# EAGLE schematic PRN_S2_v1.0 (EAGLE 9.3.0)
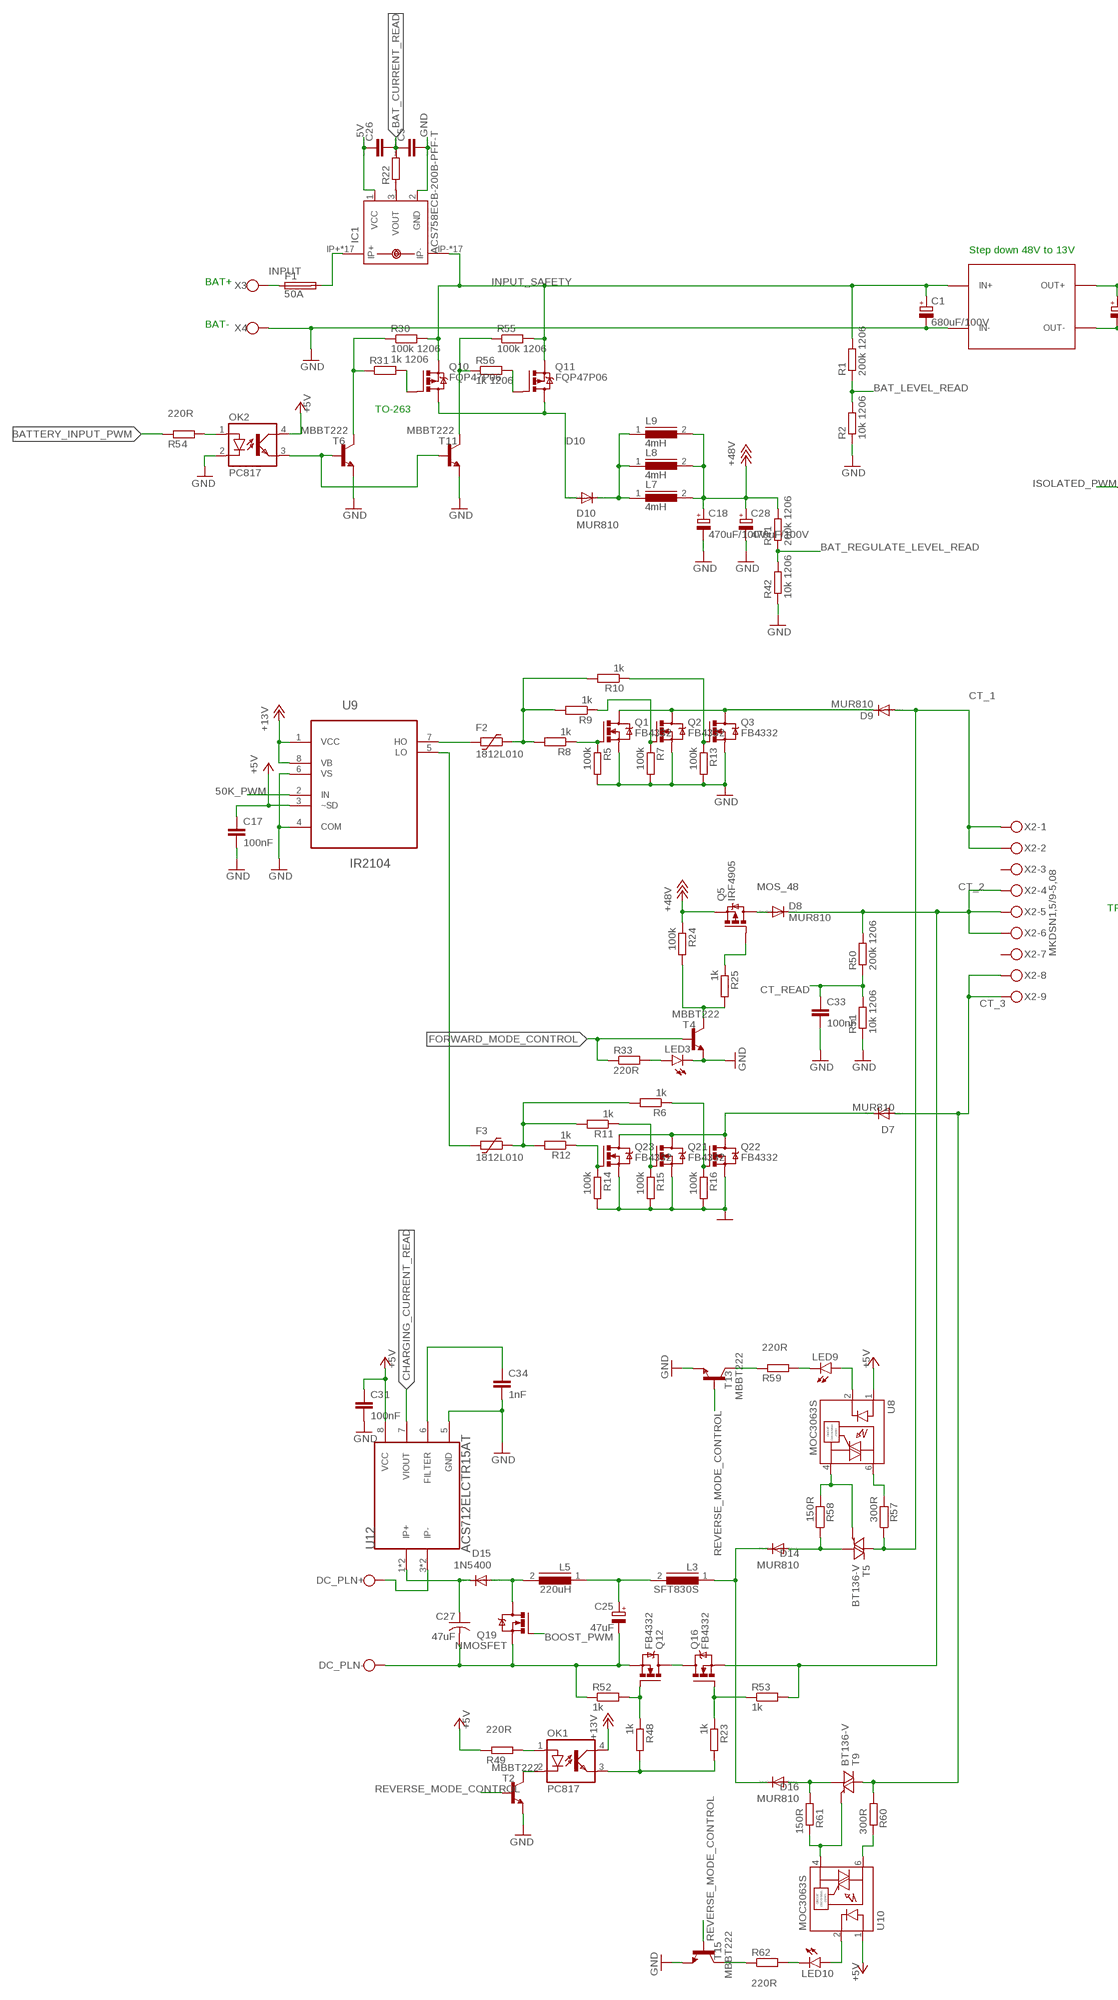
[diagram p0: schematic, sheet 1, part 1 of 2]
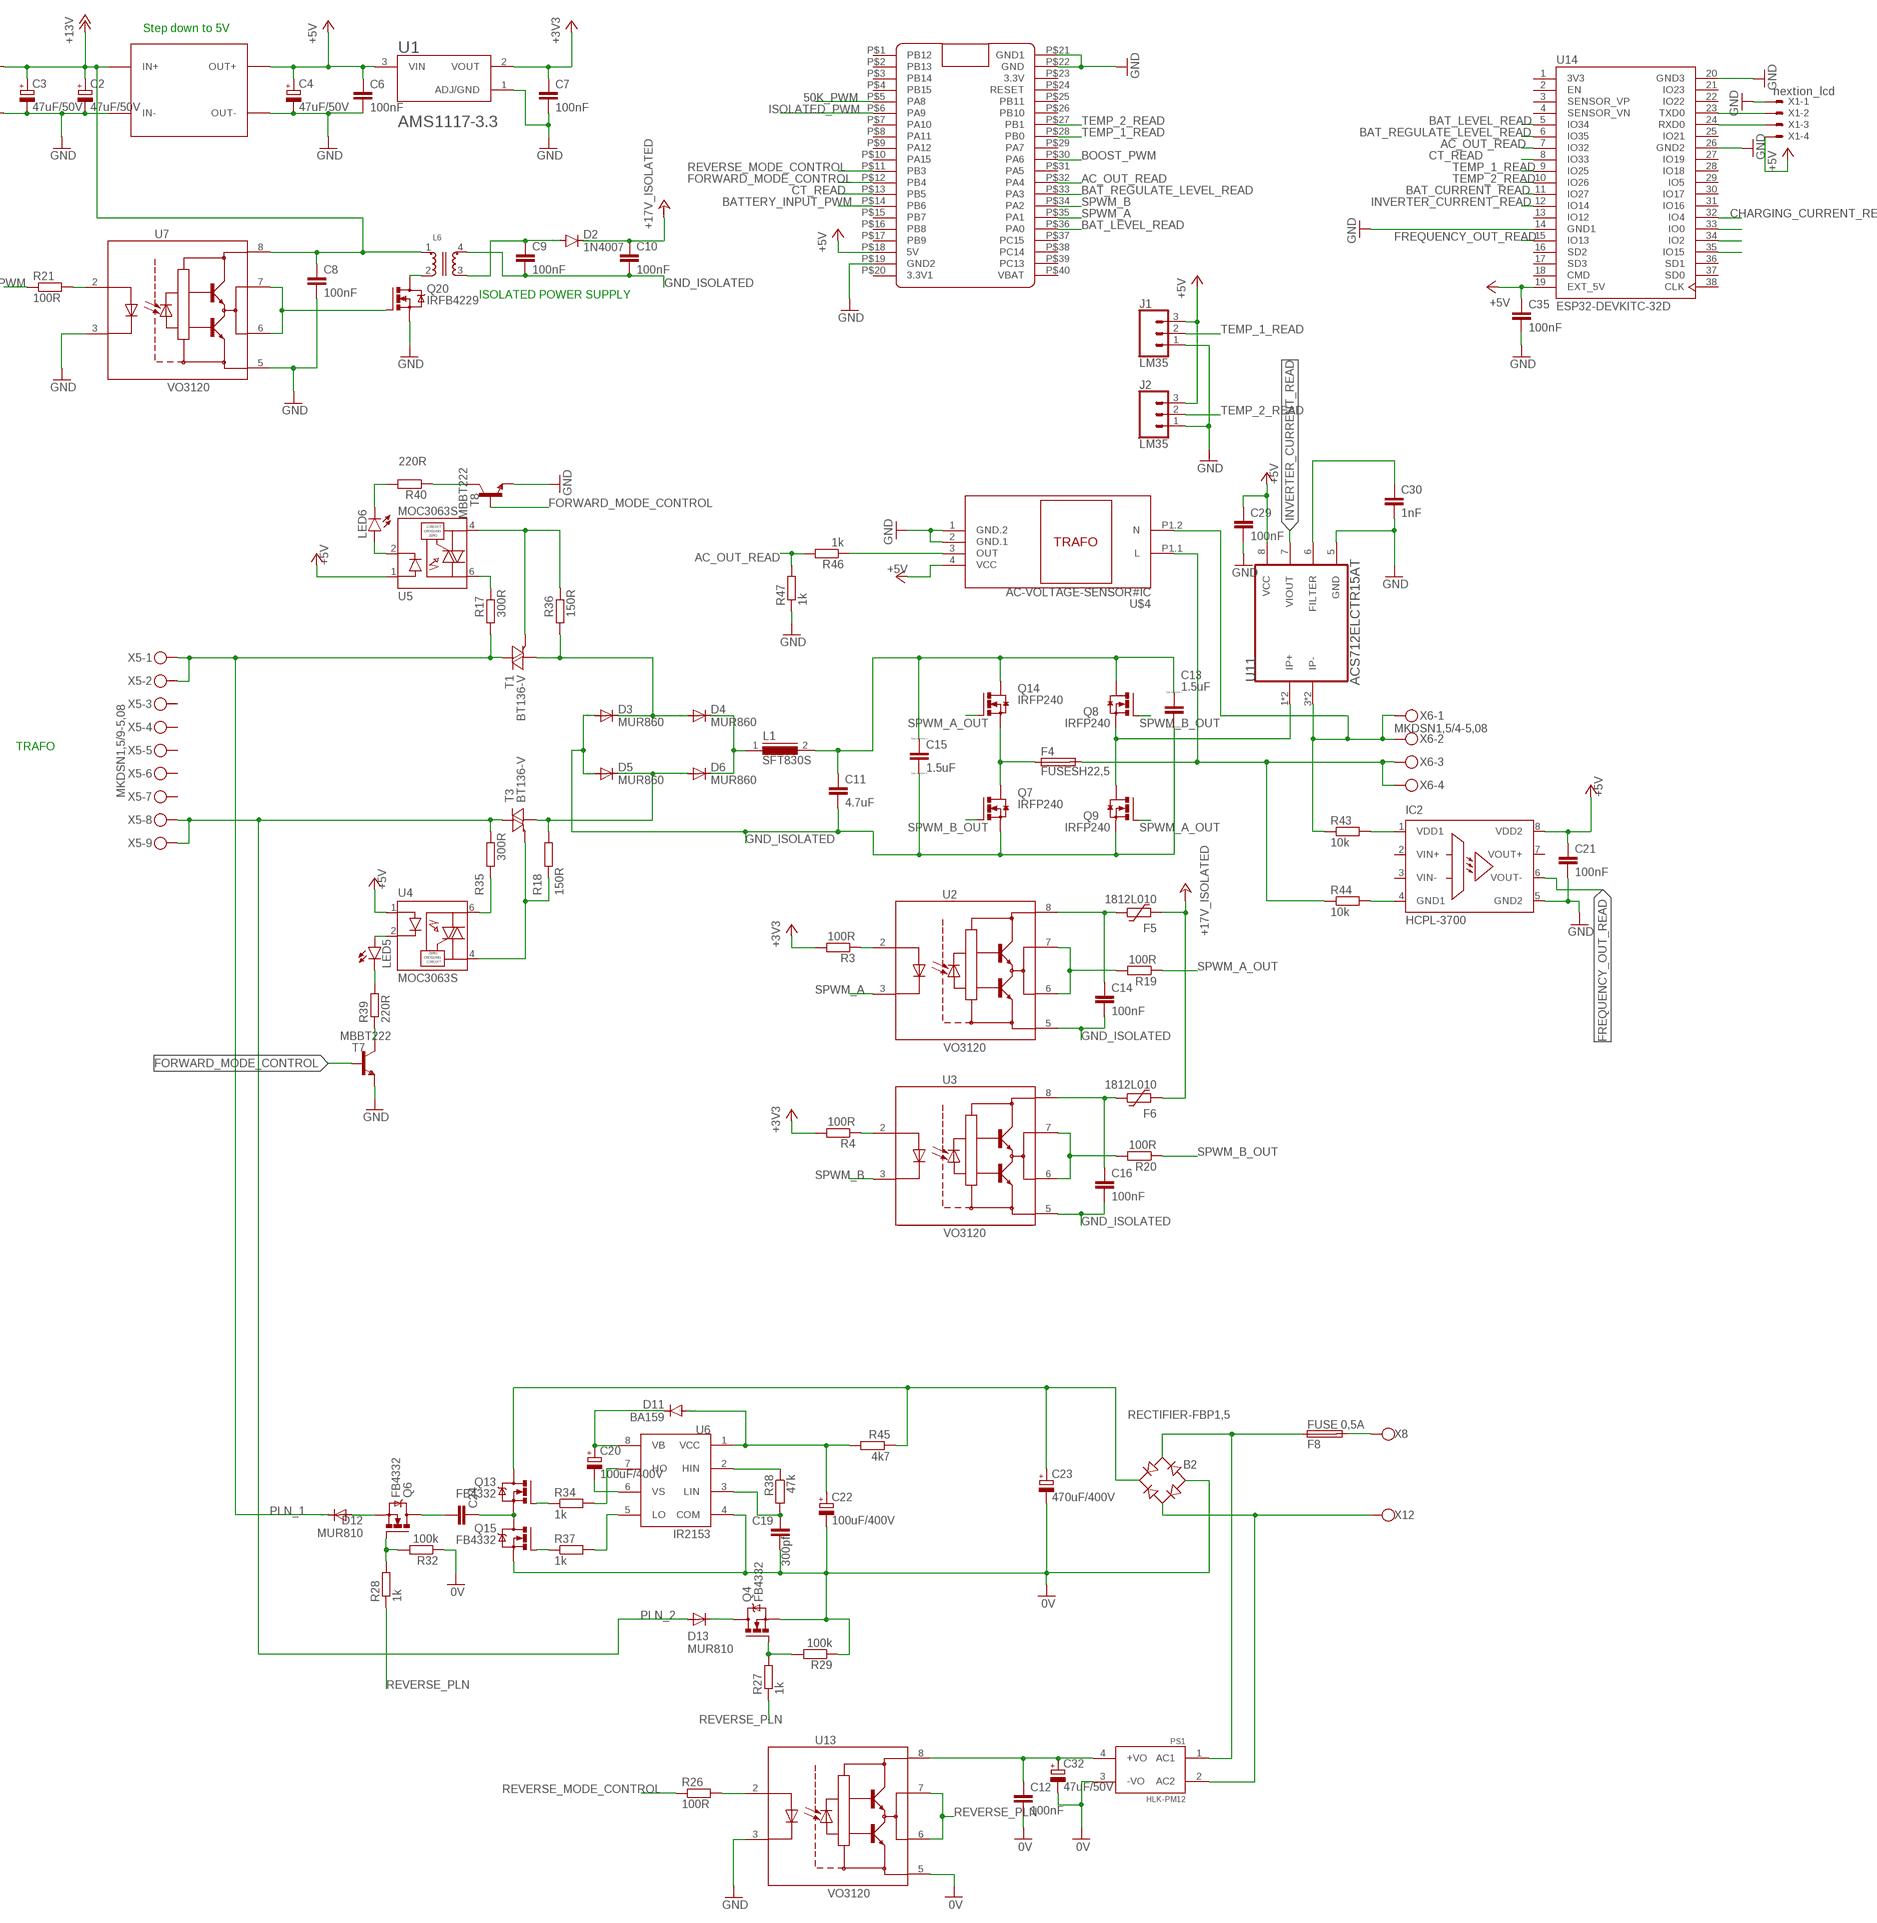
[diagram p1: schematic, sheet 1, part 2 of 2]

## Parts
B2  RECTIFIER-FBP1,5  [FBP1,5]
C1  680uF/100V  CPOL-EUE7.5-18  [E7,5-18]
C2  47uF/50V  CPOL-EUE2.5-6  [E2,5-6]
C3  47uF/50V  CPOL-EUE2.5-6  [E2,5-6]
C4  47uF/50V  CPOL-EUE2.5-6  [E2,5-6]
C5  CC0603  [C0603]
C6  100nF  C-EUC0805K  [C0805K]
C7  100nF  C-EUC0805K  [C0805K]
C8  100nF  C-EU050-025X075  [C050-025X075]
C9  100nF  C-EU050-025X075  [C050-025X075]
C10  100nF  C-EU050-025X075  [C050-025X075]
C11  4.7uF  C-EU275-113X316  [C275-113X316]
C12  100nF  C-EU050-025X075  [C050-025X075]
C13  1.5uF  C-EU150-091X182  [C150-091X182]
C14  100nF  C-EUC0805K  [C0805K]
C15  1.5uF  C-EU150-091X182  [C150-091X182]
C16  100nF  C-EUC0805K  [C0805K]
C17  100nF  C-EUC0805K  [C0805K]
C18  470uF/100V  CPOL-EUE7.5-18  [E7,5-18]
C19  300pf  C-EUC0805  [C0805]
C20  100uF/400V  CPOL-EUE7.5-18  [E7,5-18]
C21  100nF  C-EUC0805K  [C0805K]
C22  100uF/400V  CPOL-EUE7.5-18  [E7,5-18]
C23  470uF/400V  CPOL-EUE10-35  [EB35D]
C24  C-EU325-137X374  [C325-137X374]
C25  47uF  CPOL-EUE7.5-18  [E7,5-18]
C26  CC0603  [C0603]
C27  47uF  C-US050-050X075  [C050-050X075]
C28  470uF/100V  CPOL-EUE7.5-18  [E7,5-18]
C29  100nF  C-EUC0805K  [C0805K]
C30  1nF  C-EUC0805K  [C0805K]
C31  100nF  C-EUC0805K  [C0805K]
C32  47uF/50V  CPOL-EUE2.5-6  [E2,5-6]
C33  100nF  C-EU050-025X075  [C050-025X075]
C34  1nF  C-EUC0805K  [C0805K]
C35  100nF  C-EUC0805K  [C0805K]
D2  1N4007  1N4004  [DO41-10]
D3  MUR860  MUR810  [TO220ACS]
D4  MUR860  MUR810  [TO220ACS]
D5  MUR860  MUR810  [TO220ACS]
D6  MUR860  MUR810  [TO220ACS]
D7  MUR810  [TO220ACS]
D8  MUR810  [TO220ACS]
D9  MUR810  [TO220ACS]
D10  MUR810  [TO220ACS]
D11  BA159  1N4004  [DO41-10]
D12  MUR810  [TO220ACS]
D13  MUR810  [TO220ACS]
D14  MUR810  [TO220ACS]
D15  1N5400  [DO201-15]
D16  MUR810  [TO220ACS]
DC_PLN+  W237-112  [W237-112]
DC_PLN-  W237-112  [W237-112]
F1  50A  GSH15  [GSH15]
F2  1812L010  [1812L]
F3  1812L010  [1812L]
F4  FUSESH22,5  [SH22,5]
F5  1812L010  [1812L]
F6  1812L010  [1812L]
F8  FUSE 0,5A  FUSESH22,5  [SH22,5]
IC1  ACS758ECB-200B-PFF-T  [CB-PFF]
IC2  HCPL-3700  [DIL08]
J1  LM35  CONN_03  [1X03]
J2  LM35  CONN_03  [1X03]
L1  SFT830S  [SFT830S]
L3  SFT830S  [SFT830S]
L5  220uH  SFT830S  [SFT830S]
L6  WE-AMT_750082107  [WE-AMT_750082107]
L7  4mH  SFT830S  [SFT830S]
L8  4mH  SFT830S  [SFT830S]
L9  4mH  SFT830S  [SFT830S]
LED3  LEDCHIPLED_0805  [CHIPLED_0805]
LED5  LEDCHIPLED_0805  [CHIPLED_0805]
LED6  LEDCHIPLED_0805  [CHIPLED_0805]
LED9  LEDCHIPLED_0805  [CHIPLED_0805]
LED10  LEDCHIPLED_0805  [CHIPLED_0805]
OK1  PC817  [DIL04]
OK2  PC817  [DIL04]
PS1  HLK-PM12  HLK-PM03  [CONV_HLK-PM03]
Q1  FB4332  NMOSFET_TO220  [TO220BV]
Q2  FB4332  NMOSFET_TO220  [TO220BV]
Q3  FB4332  NMOSFET_TO220  [TO220BV]
Q4  FB4332  NMOSFET_TO220  [TO220BV]
Q5  IRF4905  IRF9530  [TO220BV]
Q6  FB4332  NMOSFET_TO220  [TO220BV]
Q7  IRFP240  [TO247BV]
Q8  IRFP240  [TO247BV]
Q9  IRFP240  [TO247BV]
Q10  FQP47P06  IRF9530  [TO220BV]
Q11  FQP47P06  IRF9530  [TO220BV]
Q12  FB4332  NMOSFET_TO220  [TO220BV]
Q13  FB4332  NMOSFET_TO220  [TO220BV]
Q14  IRFP240  [TO247BV]
Q15  FB4332  NMOSFET_TO220  [TO220BV]
Q16  FB4332  NMOSFET_TO220  [TO220BV]
Q19  NMOSFET  NMOSFET_TO220  [TO220BV]
Q20  IRFB4229  NMOSFET_TO220  [TO220BV]
Q21  FB4332  NMOSFET_TO220  [TO220BV]
Q22  FB4332  NMOSFET_TO220  [TO220BV]
Q23  FB4332  NMOSFET_TO220  [TO220BV]
R1  200k 1206  R-EU_R1206  [R1206]
R2  10k 1206  R-EU_R1206  [R1206]
R3  100R  R-EU_R0805  [R0805]
R4  100R  R-EU_R0805  [R0805]
R5  100k  R-EU_R0805  [R0805]
R6  1k  R-EU_R0805  [R0805]
R7  100k  R-EU_R0805  [R0805]
R8  1k  R-EU_R0805  [R0805]
R9  1k  R-EU_R0805  [R0805]
R10  1k  R-EU_R0805  [R0805]
R11  1k  R-EU_R0805  [R0805]
R12  1k  R-EU_R0805  [R0805]
R13  100k  R-EU_R0805  [R0805]
R14  100k  R-EU_R0805  [R0805]
R15  100k  R-EU_R0805  [R0805]
R16  100k  R-EU_R0805  [R0805]
R17  300R  R-EU_0207/15  [0207/15]
R18  150R  R-EU_0207/15  [0207/15]
R19  100R  R-EU_R0805  [R0805]
R20  100R  R-EU_R0805  [R0805]
R21  100R  R-EU_R0805  [R0805]
R22  RR0603  [R0603]
R23  1k  R-EU_R0805  [R0805]
R24  100k  R-EU_R0805  [R0805]
R25  1k  R-EU_R0805  [R0805]
R26  100R  R-EU_R0805  [R0805]
R27  1k  R-EU_R0805  [R0805]
R28  1k  R-EU_R0805  [R0805]
R29  100k  R-EU_R0805  [R0805]
R30  100k 1206  R-EU_R1206  [R1206]
R31  1k 1206  R-EU_R1206  [R1206]
R32  100k  R-EU_R0805  [R0805]
R33  220R  R-EU_R0805  [R0805]
R34  1k  R-EU_0207/12  [0207/12]
R35  300R  R-EU_0207/15  [0207/15]
R36  150R  R-EU_0207/15  [0207/15]
R37  1k  R-EU_0207/12  [0207/12]
R38  47k  R-EU_0617/17  [0617/17]
R39  220R  R-EU_R0805  [R0805]
R40  220R  R-EU_R0805  [R0805]
R41  200k 1206  R-EU_R1206  [R1206]
R42  10k 1206  R-EU_R1206  [R1206]
R43  10k  R-EU_0207/12  [0207/12]
R44  10k  R-EU_0207/12  [0207/12]
R45  4k7  R-EU_0617/17  [0617/17]
R46  1k  R-EU_R1206  [R1206]
R47  1k  R-EU_R1206  [R1206]
R48  1k  R-EU_R0805  [R0805]
R49  220R  R-EU_R0805  [R0805]
R50  200k 1206  R-EU_R1206  [R1206]
R51  10k 1206  R-EU_R1206  [R1206]
R52  1k  R-EU_R0805  [R0805]
R53  1k  R-EU_R0805  [R0805]
R54  220R  R-EU_R0805  [R0805]
R55  100k 1206  R-EU_R1206  [R1206]
R56  1k 1206  R-EU_R1206  [R1206]
R57  300R  R-EU_0207/15  [0207/15]
R58  150R  R-EU_0207/15  [0207/15]
R59  220R  R-EU_R0805  [R0805]
R60  300R  R-EU_0207/15  [0207/15]
R61  150R  R-EU_0207/15  [0207/15]
R62  220R  R-EU_R0805  [R0805]
T1  BT136-V  BT138-V  [TO220BV]
T2  MBBT222  -NPN-SOT23-EBC  [SOT23-EBC]
T3  BT136-V  BT138-V  [TO220BV]
T4  MBBT222  -NPN-SOT23-EBC  [SOT23-EBC]
T5  BT136-V  BT138-V  [TO220BV]
T6  MBBT222  -NPN-SOT23-EBC  [SOT23-EBC]
T7  MBBT222  -NPN-SOT23-EBC  [SOT23-EBC]
T8  MBBT222  -NPN-SOT23-EBC  [SOT23-EBC]
T9  BT136-V  BT138-V  [TO220BV]
T11  MBBT222  -NPN-SOT23-EBC  [SOT23-EBC]
T13  MBBT222  -NPN-SOT23-EBC  [SOT23-EBC]
T15  MBBT222  -NPN-SOT23-EBC  [SOT23-EBC]
U1  AMS1117-3.3  [SOT229P700X180-4N]
U2  VO3120  [DIP762W50P254L977H451Q8]
U3  VO3120  [DIP762W50P254L977H451Q8]
U4  MOC3063S  [DIP762W50P254L730H500Q6]
U5  MOC3063S  [DIP762W50P254L730H500Q6]
U6  IR2153  IR2101  [DIL08]
U7  VO3120  [DIP762W50P254L977H451Q8]
U8  MOC3063S  [DIP762W50P254L730H500Q6]
U9  IR2104  [DIP254P762X533-8]
U10  MOC3063S  [DIP762W50P254L730H500Q6]
U11  ACS712ELCTR15AT  ACS712ELCTR30AT  [SOIC127P600X175-8N]
U12  ACS712ELCTR15AT  ACS712ELCTR30AT  [SOIC127P600X175-8N]
U13  VO3120  [DIP762W50P254L977H451Q8]
U14  ESP32-DEVKITC-32D  [MODULE_ESP32-DEVKITC-32D]
U$1  DC-DC-STEP-DOWN-LM2596  [DC-DC-STEP-DOWN-LM2596]
U$2  DC-DC-STEP-DOWN-LM2596  [DC-DC-STEP-DOWN-LM2596]
U$3  BLUE_PILL  [BLUE_PILL]
U$4  AC-VOLTAGE-SENSOR#IC  [AC-VOLTAGE-SENSOR#IC]
X1  nextion_lcd  22-23-2041  [22-23-2041]
X2  MKDSN1,5/9-5,08  [MKDSN1,5/9-5,08]
X3  W237-112  [W237-112]
X4  W237-112  [W237-112]
X5  MKDSN1,5/9-5,08  [MKDSN1,5/9-5,08]
X6  MKDSN1,5/4-5,08  [MKDSN1,5/4-5,08]
X8  W237-112  [W237-112]
X12  W237-112  [W237-112]

## Nets
0V: B2.- C12.2 C19.2 C22.- C23.- C32.- PS1.3(-VO) Q4.S Q15.S R29.1 R32.1 U6.4(COM) U13.5(VEE)
5V: C26.1 IC1.1(VCC)
50K_PWM: U9.2(IN) U$3.P$5(PA8)
+3V3: C7.1 R3.2 R4.2 U1.2(VOUT)
+5V: C4.+ C6.1 C17.1 C21.1 C29.1 C31.1 C35.1 IC2.8(VDD2) J1.3 J2.3 OK2.4(COL) R49.1 U1.3(VIN) U4.1(ANODE) U5.1(ANODE) U8.1(ANODE) U9.3(~SD) U10.1(ANODE) U11.8(VCC) U12.8(VCC) U14.19(EXT_5V) U$2.OUT+ U$3.P$18(5V) U$4.4(VCC) X1.4
+12V: C2.+ C3.+ C8.1 L6.1 OK1.4(COL) U7.8(VCC) U9.1(VCC) U9.8(VB) U$1.OUT+ U$2.IN+ ; supply symbol labelled +13V
+18V: C18.+ C28.+ L7.2 L8.2 L9.2 Q5.S R24.1 R41.2 ; supply symbol labelled +48V
+24V: C10.1 D2.C F5.2 F6.2 ; supply symbol labelled +17V_ISOLATED
A: D9.C Q1.D Q2.D Q3.D
AC_OUT_READ: R46.2 R47.2 U14.7(IO32) U$3.P$32(PA4)
AFTER_D10: D10.C L7.1 L8.1 L9.1
B: D7.C Q21.D Q22.D Q23.D
BAT_CURRENT_READ: C5.1 C26.2 R22.2 U14.11(IO27)
BAT_LEVEL_READ: R1.1 R2.2 U14.5(IO34) U$3.P$36(PA0)
BAT_REGULATE_LEVEL_READ: R41.1 R42.2 U14.6(IO35) U$3.P$33(PA3)
BATTERY_INPUT_PWM: R54.1 U$3.P$14(PB6)
BOOST_PWM: Q19.G U$3.P$30(PA6)
CHARGING_CURRENT_READ: U12.7(VIOUT) U14.32(IO4)
CT_1: D9.A R57.1 T5.T2(A2) X2.1 X2.2
CT_2: D8.C Q16.S R50.2 R53.2 X2.4 X2.5 X2.6
CT_3: D7.A R60.1 T9.T2(A2) X2.8 X2.9
CT_READ: C33.1 R50.1 R51.2 U14.8(IO33) U$3.P$13(PB5)
D10: D10.A Q10.D Q11.D
DC_PLN: C27.1 D15.C U12.1(IP+) U12.2(IP+)
DC_PLN+: DC_PLN+.1(KL) U12.3(IP-) U12.4(IP-)
DC_PLN-: C25.- C27.2 DC_PLN-.1(KL) Q12.S Q19.S R52.1
FORWARD_MODE_CONTROL: R33.1 T4.B T7.B T8.B U$3.P$12(PB4)
FREQUENCY_OUT_READ: IC2.6(VOUT-) U14.15(IO13)
GG: OK2.3(EMIT) T6.B T11.B
GND: C1.- C2.- C3.- C4.- C5.2 C6.2 C7.2 C8.2 C17.2 C18.- C21.2 C28.- C29.2 C30.2 C31.2 C33.2 C34.2 C35.2 IC1.2(GND) IC2.5(GND2) J1.1 J2.1 LED3.C OK2.2(C) Q1.S Q2.S Q3.S Q20.S Q21.S Q22.S Q23.S R2.1 R5.2 R7.2 R13.2 R14.2 R15.2 R16.2 R42.1 R47.1 R51.1 T2.E T4.E T6.E T7.E T8.E T11.E T13.E T15.E U1.1(ADJ/GND) U7.3(C) U7.5(VEE) U9.4(COM) U9.6(VS) U11.5(GND) U12.5(GND) U13.3(C) U14.14(GND1) U14.20(GND3) U14.26(GND2) U$1.IN- U$1.OUT- U$2.IN- U$2.OUT- U$3.P$19(GND2) U$3.P$21(GND1) U$3.P$22(GND) U$4.1(GND.2) U$4.2(GND.1) X1.1 X4.1(KL)
GND_ISOLATED: C9.2 C10.2 C11.2 C13.2 C14.2 C15.2 C16.2 D3.A D5.A L6.4 Q7.S Q9.S U2.5(VEE) U3.5(VEE)
IN_48V: F1.2 IC1.IP+ IC1.IP+@2(IP+) IC1.IP+@3(IP+) IC1.IP+@4(IP+) IC1.IP+@5(IP+) IC1.IP+@6(IP+) IC1.IP+@7(IP+) IC1.IP+@8(IP+) IC1.IP+@9(IP+) IC1.IP+@10(IP+) IC1.IP+@11(IP+) IC1.IP+@12(IP+) IC1.IP+@13(IP+) IC1.IP+@14(IP+) IC1.IP+@15(IP+) IC1.IP+@16(IP+) IC1.IP+@17(IP+)
INPUT: F1.1 X3.1(KL)
INPUT_SAFETY: C1.+ IC1.IP- IC1.IP-@2(IP-) IC1.IP-@3(IP-) IC1.IP-@4(IP-) IC1.IP-@5(IP-) IC1.IP-@6(IP-) IC1.IP-@7(IP-) IC1.IP-@8(IP-) IC1.IP-@9(IP-) IC1.IP-@10(IP-) IC1.IP-@11(IP-) IC1.IP-@12(IP-) IC1.IP-@13(IP-) IC1.IP-@14(IP-) IC1.IP-@15(IP-) IC1.IP-@16(IP-) IC1.IP-@17(IP-) Q10.S Q11.S R1.2 R30.2 R55.2 U$1.IN+
INVERTER_CURRENT_READ: U11.7(VIOUT) U14.12(IO14)
ISOLATED_PWM: R21.1 U$3.P$6(PA9)
MOS_48: D8.A Q5.D
N$1: U14.35(IO15)
N$2: Q5.G R25.1
N$3: Q20.G U7.6(VO1) U7.7(VO2)
N$4: L6.2 Q20.D
N$5: Q10.G R31.2
N$6: Q11.G R56.2
N$7: IC1.3(VOUT) R22.1
N$8: F2.1 R8.2 R9.2 R10.2
N$9: C9.1 D2.A L6.3
N$10: Q13.G R34.1
N$11: LED3.A R33.2
N$12: F3.1 R6.2 R11.2 R12.2
N$13: Q2.G R7.1 R9.1
N$14: Q21.G R11.1 R15.1
N$15: Q22.G R6.1 R16.1
N$16: R46.1 U$4.3(OUT)
N$17: C30.1 U11.6(FILTER)
N$18: U14.23(TXD0) X1.2
N$19: R17.2 U5.6(MAIN_TERM1)
N$20: R18.1 T3.G U4.4(MAIN_TERM2)
N$21: D13.C Q4.D
N$22: R36.2 T1.G U5.4(MAIN_TERM2)
N$23: D3.C D4.A R36.1 T1.T1(A1)
N$24: C14.1 F5.1 U2.8(VCC)
N$25: D4.C D6.C L1.1
N$26: D5.C D6.A R18.2 T3.T1(A1)
N$27: R19.2 U2.6(VO1) U2.7(VO2)
N$28: C34.1 U12.6(FILTER)
N$29: F4.1 Q7.D Q14.S
N$30: C11.1 C13.1 C15.1 L1.2 Q8.D Q14.D
N$31: R43.1 U11.3(IP-) U11.4(IP-) U$4.P1.2(N) X6.1 X6.2
N$32: F4.2 R44.1 U$4.P1.1(L) X6.3 X6.4
N$33: Q8.S Q9.D U11.1(IP+) U11.2(IP+)
N$34: LED5.A U4.2(CATHODE)
N$35: R20.2 U3.6(VO1) U3.7(VO2)
N$36: C16.1 F6.1 U3.8(VCC)
N$37: Q15.G R37.1
N$38: R3.1 U2.2(A)
N$39: R4.1 U3.2(A)
N$40: R21.2 U7.2(A)
N$41: R24.2 R25.2 T4.C
N$42: F3.2 U9.5(LO)
N$43: C24.1 Q13.S Q15.D
N$44: Q12.G R48.1 R52.2
N$45: C24.2 Q6.D
N$46: Q6.G R28.2 R32.2
N$47: R35.1 U4.6(MAIN_TERM1)
N$48: R26.2 U13.2(A)
N$49: OK1.2(C) T2.C
N$50: IC2.4(GND1) R44.2
N$51: F2.2 U9.7(HO)
N$52: Q1.G R5.1 R8.1
N$53: R55.1 R56.1 T11.C
N$54: Q23.G R12.1 R14.1
N$55: Q4.G R27.2 R29.2
N$56: R30.1 R31.1 T6.C
N$57: U14.24(RXD0) X1.3
N$58: U14.34(IO2)
N$59: LED5.C R39.2
N$60: Q3.G R10.1 R13.1
N$61: R39.1 T7.C
N$62: LED6.A U5.2(CATHODE)
N$63: LED6.C R40.2
N$64: R40.1 T8.C
N$65: F8.2 X8.1(KL)
N$66: IC2.1(VDD1) R43.2
N$67: C12.1 C32.+ PS1.4(+VO) U13.8(VCC)
N$68: R38.1 U6.2(HIN)
N$69: C19.1 R38.2 U6.3(LIN)
N$70: C20.- U6.6(VS)
N$71: D12.A Q6.S
N$72: Q12.D Q16.D
N$73: R34.2 U6.7(HO)
N$74: R37.2 U6.5(LO)
N$75: OK1.3(EMIT) R23.2 R48.2
N$76: B2.AC2 PS1.2(AC2) X12.1(KL)
N$77: B2.AC1 F8.1 PS1.1(AC1)
N$78: OK1.1(A) R49.2
N$79: B2.+ C23.+ Q13.D R45.1
N$80: Q16.G R23.1 R53.1
N$81: OK2.1(A) R54.2
N$82: U14.33(IO0)
N$86: R57.2 U8.6(MAIN_TERM1)
N$90: R58.2 T5.G U8.4(MAIN_TERM2)
N$91: D15.A L5.2 Q19.D
N$92: D14.A R58.1 T5.T1(A1)
N$93: D16.A R61.1 T9.T1(A1)
N$94: D14.C D16.C L3.1
N$95: C25.+ L3.2 L5.1
N$96: LED9.A U8.2(CATHODE)
N$100: LED9.C R59.2
N$101: R59.1 T13.C
N$103: R60.2 U10.6(MAIN_TERM1)
N$104: R61.2 T9.G U10.4(MAIN_TERM2)
N$105: LED10.A U10.2(CATHODE)
N$106: LED10.C R62.2
N$107: R62.1 T15.C
PLN_1: D12.C R17.1 T1.T2(A2) X5.1 X5.2
PLN_2: D13.A R35.2 T3.T2(A2) X5.8 X5.9
REVERSE_MODE_CONTROL: R26.1 T2.B T13.B T15.B U$3.P$11(PB3)
REVERSE_PLN: R27.1 R28.1 U13.6(VO1) U13.7(VO2)
SPWM_A: U2.3(C) U$3.P$35(PA1)
SPWM_A_OUT: Q9.G Q14.G R19.1
SPWM_B: U3.3(C) U$3.P$34(PA2)
SPWM_B_OUT: Q7.G Q8.G R20.1
TEMP_1_READ: J1.2 U14.9(IO25) U$3.P$28(PB0)
TEMP_2_READ: J2.2 U14.10(IO26) U$3.P$27(PB1)
VB: C20.+ D11.C U6.8(VB)
VCC: C22.+ D11.A R45.2 U6.1(VCC)
Unconnected: U14.2(EN) U14.3(SENSOR_VP) U14.4(SENSOR_VN) U14.13(IO12) U14.16(SD2) U14.17(SD3) U14.18(CMD) U14.21(IO23) U14.22(IO22) U14.25(IO21) U14.27(IO19) U14.28(IO18) U14.29(IO5) U14.30(IO17) U14.31(IO16) U14.36(SD1) U14.37(SD0) U14.38(CLK) U$3.P$1(PB12) U$3.P$2(PB13) U$3.P$3(PB14) U$3.P$4(PB15) U$3.P$7(PA10) U$3.P$8(PA11) U$3.P$9(PA12) U$3.P$10(PA15) U$3.P$15(PB7) U$3.P$16(PB8) U$3.P$17(PB9) U$3.P$20(3.3V1) U$3.P$23(3.3V) U$3.P$24(RESET) U$3.P$25(PB11) U$3.P$26(PB10) U$3.P$29(PA7) U$3.P$31(PA5) U$3.P$37(PC15) U$3.P$38(PC14) U$3.P$39(PC13) U$3.P$40(VBAT) X2.3 X2.7 X5.3 X5.4 X5.5 X5.6 X5.7

## Notes on the sheet
- Step down 48V to 13V | Step down to 5V
- BAT+
- BAT-
- TO-263
- ISOLATED POWER SUPPLY
- TRAFO

## Power pins joined to a net without a drawn wire
3V3: U14.1(3V3)
VIN+: IC2.2(VIN+)
VIN-: IC2.3(VIN-)
VOUT+: IC2.7(VOUT+)

## Library data of the parts
B2 = rectifier:RECTIFIER-: Rectifier
C1 C18 C28 = rcl:CPOL-EU: POLARIZED CAPACITOR, European symbol
C2-C4 C20 C22 C23 C32 = rcl:CPOL-EU: POLARIZED CAPACITOR, European symbol; SPICEPREFIX: C
C5 C26 = eagle-ltspice:C: CAPACITOR, European symbol; SPICEMODEL: NONE; SPICEPREFIX: C
C6-C10 C12 C14 C16 C17 C21 C29-C31 C33-C35 = rcl:C-EU: CAPACITOR, European symbol; SPICEPREFIX: C
C11 = rcl:C-EU: CAPACITOR, European symbol
C13 C15 = resistor:C-EU: CAPACITOR, European symbol; SPICEPREFIX: C
C19 C24 = rcl@1:C-EU: CAPACITOR, European symbol; SPICEPREFIX: C
C25 = rcl@1:CPOL-EU: POLARIZED CAPACITOR, European symbol; SPICEPREFIX: C
C27 = rcl:C-US: CAPACITOR, American symbol
D2 = diode:1N4004: DIODE general purpose rectifier, 1 A
D3-D10 D12-D14 D16 = diode:MUR810: DIODE
D11 = diode@1:1N4004: DIODE general purpose rectifier, 1 A
D15 = diode:1N5400: DIODE standard rectifier, 3 A, 50 V (Motorola)
DC_PLN+ DC_PLN- X3 X4 X8 X12 = con-wago-500:W237-112: WAGO SCREW CLAMP; MPN: 237-112; OC_FARNELL: unknown; OC_NEWARK: 76R2974
F1 = fuse:GSH15: FUSE HOLDER grid 15mm, 19649 Wickmann; MPN: 64900001039; OC_FARNELL: 1271673; OC_NEWARK: 02P0318
F2 F3 F5 F6 = polyfuse-smd_1812:?: Polyfuse Resettable PTC Source: http://www.littelfuse.com/products/resettable-ptcs.aspx; MF: Littelfuse; MPN: 1812L010; OC_FARNELL: 1822210; OC_NEWARK: 78R5551
F4 F8 = fuse:FUSE: Fuse; OC_FARNELL: unknown; OC_NEWARK: unknown
IC1 = ACS758:ACS758*: Thermally Enhanced, Fully Integrated, Hall Effect-Based Linear Current Sensor with 100 micro Ohm Current Conductor display layer 49 Reference in BRD and place VIAs on circles Source: http://www.allegromicro.com/en/Products/Part_Numbers/0758/0758.pdf; MPN: ACS758ECB-200B-PFF-T; OC_FARNELL: 1718993; OC_NEWARK: 04R7127
IC2 = HCPL-3700:HCPL-3700: Isolation Amplifer Source: http://www.avagotech.com/docs/AV02-0410EN Check prices <https://pricing.snapeda.com/parts/HCPL3700/ON/view-part?ref=eda>; AVAILABILITY: In Stock; DESCRIPTION: Optoisolator Darlington Output 2500Vrms 1 Channel 8-SMD; MF: ON; MP: HCPL3700; PACKAGE: DIP-8 Fairchild Semiconductor; PRICE: None; PURCHASE-URL: https://pricing.snapeda.com/search/part/HCPL3700/?ref=eda
J1 J2 = SparkFun-Connectors:CONN_03: Multi connection point. Often used as Generic Header-pin footprint for 0.1 inch spaced/style header connections On any of the 0.1 inch spaced packages, you can populate with these: Break Away Headers - Straight <https://www.sparkfun.com/products/116> (PRT-00116) Break Away Male Headers - Right Angle <https://www.sparkfun.com/products/553> (PRT-00553) Female Headers <https://www.sparkfun.com/products/115> (PRT-00115) Break Away Headers - Machine Pin <https://www.sparkfun.com/products/117> (PRT-00117) Break Away Female Headers - Swiss Machine Pin <https://www.sparkfun.com/products/743> (PRT-00743) Stackable Header - 3 Pin (Female, 0.1") <https://www.sparkfun.com/products/13875> (PRT-13875) For SCREWTERMINALS and SPRING TERMINALS visit here: Screw Terimnals on SparkFun.com <https://www.sparkfun.com/search/results?term=Screw+Terminals> (5mm/3.5mm/2.54mm spacing) This device is also useful as a general connection point to wire up your design to another part of your project. Our various solder wires solder well into these plated through hole pads. Hook-Up Wire - Assortment (Stranded, 22 AWG) <https://www.sparkfun.com/products/11375> (PRT-11375) Hook-Up Wire - Assortment (Solid Core, 22 AWG) <https://www.sparkfun.com/products/11367> (PRT-11367) View the entire wire category on our website here <https://www.sparkfun.com/categories/141> Special notes: Molex polarized connector foot print use with SKU : PRT-08232 with associated crimp pins and housings.; PROD_ID: XXX-00000; VALUE: 455-1750-1-ND
L1 L3 L5 L7-L9 = inductors:SFT830S: INDUCTOR
L6 = EMI_FILTER:WE-AMT: MID-AMT Analog Modem Transformer Characteristics UL/IEC/EN 60950 compatible V.29-UL1950 Applications Analog Modems <http://katalog.we-online.de/media/images/ctm/mid-amt_pf2.jpg> Details see: http://katalog.we-online.de/en/ctm/MID-AMT/?m Updated on 2014-06-19 2014 (C) Wurth Elektronik
LED3 LED5 LED6 LED9 LED10 = led:LED: LED OSRAM: - CHIPLED LG R971, LG N971, LY N971, LG Q971, LY Q971, LO R971, LY R971 LH N974, LH R974 LS Q976, LO Q976, LY Q976 LO Q996 - Hyper CHIPLED LW Q18S LB Q993, LB Q99A, LB R99A - SideLED LS A670, LO A670, LY A670, LG A670, LP A670 LB A673, LV A673, LT A673, LW A673 LH A674 LY A675 LS A676, LA A676, LO A676, LY A676, LW A676 LS A679, LY A679, LG A679 - Hyper Micro SIDELED® LS Y876, LA Y876, LO Y876, LY Y876 LT Y87S - SmartLED LW L88C, LW L88S LB L89C, LB L89S, LG L890 LS L89K, LO L89K, LY L89K LS L896, LA L896, LO L896, LY L896 - TOPLED LS T670, LO T670, LY T670, LG T670, LP T670 LSG T670, LSP T670, LSY T670, LOP T670, LYG T670 LG T671, LOG T671, LSG T671 LB T673, LV T673, LT T673, LW T673 LH T674 LS T676, LA T676, LO T676, LY T676, LB T676, LH T676, LSB T676, LW T676 LB T67C, LV T67C, LT T67C, LS T67K, LO T67K, LY T67K, LW E67C LS E67B, LA E67B, LO E67B, LY E67B, LB E67C, LV E67C, LT E67C LW T67C LS T679, LY T679, LG T679 LS T770, LO T770, LY T770, LG T770, LP T770 LB T773, LV T773, LT T773, LW T773 LH T774 LS E675, LA E675, LY E675, LS T675 LS T776, LA T776, LO T776, LY T776, LB T776 LHGB T686 LT T68C, LB T68C - Hyper Mini TOPLED® LB M676 - Mini TOPLED Santana® LG M470 LS M47K, LO M47K, LY M47K Source: http://www.osram.convergy.de LUXEON: - LUMILED® LXK2-PW12-R00, LXK2-PW12-S00, LXK2-PW14-U00, LXK2-PW14-V00 LXK2-PM12-R00, LXK2-PM12-S00, LXK2-PM14-U00 LXK2-PE12-Q00, LXK2-PE12-R00, LXK2-PE12-S00, LXK2-PE14-T00, LXK2-PE14-U00 LXK2-PB12-K00, LXK2-PB12-L00, LXK2-PB12-M00, LXK2-PB14-N00, LXK2-PB14-P00, LXK2-PB14-Q00 LXK2-PR12-L00, LXK2-PR12-M00, LXK2-PR14-Q00, LXK2-PR14-R00 LXK2-PD12-Q00, LXK2-PD12-R00, LXK2-PD12-S00 LXK2-PH12-R00, LXK2-PH12-S00 LXK2-PL12-P00, LXK2-PL12-Q00, LXK2-PL12-R00 Source: www.luxeon.com KINGBRIGHT: KA-3528ASYC Source: www.kingbright.com
OK1 OK2 = optocoupler:PC817: SHARP OPTO COUPLER; MPN: PC817X4J000F; OC_FARNELL: 9707727; OC_NEWARK: 97K7059
PS1 = HLK-PM03:HLK-PM03: AC DC 3W power module Check prices <https://pricing.snapeda.com/parts/HLK-PM03/Hi-link/view-part?ref=eda>; AVAILABILITY: Not in stock; MF: Hi-link; MP: HLK-PM03; PACKAGE: Package; PRICE: None
Q1-Q4 Q6 Q12 Q13 Q15 Q16 Q20-Q23 = Transistor:NMOSFET: N-Channel MOSFET - Generic; CATEGORY: Transistor; SUB-CATEGORY: MOSFET; TYPE: N-Channel; VALUE: NMOSFET
Q5 Q10 Q11 = transistor-power:IRF9530: P-CHANNEL HEXFET POWER-MOS-FET Source: http://www.irf.com/product-info/datasheets/data/irf9530.pdf
Q7-Q9 Q14 = transistor-power:IRFP240: HEXFET Power MosFet Source: http://www.irf.com/
Q19 = Transistor:NMOSFET: N-Channel MOSFET - Generic; CATEGORY: Transistor; SUB-CATEGORY: MOSFET; TYPE: N-Channel
R1-R21 R23-R37 R39-R44 R46-R62 = rcl:R-EU_: RESISTOR, European symbol; SPICEPREFIX: R
R22 = eagle-ltspice:R: RESISTOR, European symbol; SPICEMODEL: NONE; SPICEPREFIX: R
R38 R45 = rcl@1:R-EU_: RESISTOR, European symbol; SPICEPREFIX: R
T1 T3 T5 T9 = triac:BT138: TRIAC Source: http://www.semiconductors.philips.com BT138_SERIES_2.pdf
T2 T4 T6-T8 T11 T13 T15 = transistor:*-NPN-: NPN Transistror BF959 corrected 2008.03.06
U1 = AMS1117-3.3:AMS1117-3.3: Sot223/Pkg 1-Amp 3.3-Volt Low Drop Out Voltage Regulatator; AVAILABILITY: Unavailable; DESCRIPTION: Sot-89; MF: ams; MP: AMS1117-3.3; PACKAGE: SOT-89 ams; PRICE: None
U2 U3 U7 U13 = VO3120:VO3120: 2.5 A Output Current IGBT and MOSFET Driver Check prices <https://pricing.snapeda.com/parts/VO3120/Vishay%20Semiconductor/view-part?ref=eda>; AVAILABILITY: Good; DESCRIPTION: 2.5A Gate Driver Optical Coupling 5300Vrms 1 Channel 8-DIP; MF: Vishay Semiconductor; MP: VO3120; PACKAGE: DIP-8 Vishay Semiconductor; PRICE: None; PURCHASE-URL: https://pricing.snapeda.com/search/part/VO3120/?ref=eda
U4 U5 U8 U10 = MOC3063:MOC3063: 6-DIP Through Hole Optoisolator Check prices <https://pricing.snapeda.com/parts/MOC3063/Lite-On%20Inc./view-part?ref=eda>; AVAILABILITY: In Stock; DESCRIPTION: 6-DIP Through Hole Optoisolator; MF: Lite-On Inc.; MP: MOC3063; PACKAGE: DIP-6 Motorola; PRICE: None; PURCHASE-URL: https://pricing.snapeda.com/search/part/MOC3063/?ref=eda
U6 = irf-2:IR2101: High and low side driver
U9 = IR2104:IR2104: HALF BRIDGE DRIVER Check prices <https://pricing.snapeda.com/parts/IR2104/Infineon%20Technologies/view-part?ref=eda>; AVAILABILITY: Bad; DESCRIPTION: Half-Bridge Gate Driver IC Non-Inverting 8-PDIP; MF: Infineon Technologies; MP: IR2104; PACKAGE: DIP-8 Infineon; PRICE: None
U11 U12 = ACS712-ELCTR30AT:ACS712ELCTR30AT: Sensor: current; Package: SO8; Usup: 4.5÷5.5VDC; Iin: ± 30A; 66mV Check prices <https://pricing.snapeda.com/parts/ACS712ELCTR-30A-T/Allegro/view-part?ref=eda>; AVAILABILITY: Bad; DESCRIPTION: Current Sensor 30A 1 Channel Hall Effect, Open Loop Bidirectional 8-SOIC (0.154, 3.90mm Width); MF: Allegro; MP: ACS712ELCTR-30A-T; PACKAGE: SOIC-8 Allegro MicroSystems LLC; PRICE: None
U14 = ESP32-DEVKITC-32D:ESP32-DEVKITC-32D: Eval Board For Esp-Wroom-32 Check prices <https://pricing.snapeda.com/parts/ESP32-DEVKITC-32D/Espressif%20Systems/view-part?ref=eda>; AVAILABILITY: In Stock; DESCRIPTION: WiFi Development Tools (802.11) ESP32 General Development Kit, ESP32-WROOM-32D on the board; MF: Espressif Systems; MP: ESP32-DEVKITC-32D; PACKAGE: None; PRICE: None
U$1 U$2 = diy-modules:DC-DC-STEP-DOWN-LM2596: DC/DC Step-Down Regulator based on LM2596-ADJ chip LM2596 datasheet available here: http://www.ti.com/lit/ds/symlink/lm2596.pdf Click here to find device on ebay.com <http://www.ebay.com/sch/lm2596+power+regulator>
U$3 = BluePill:BLUE_PILL
U$4 = zmpt101b:AC-VOLTAGE-SENSOR#IC: Isolated AC Voltage Sensor based on ZMPT101B transformer Symbol with input connector ZMPT101B Voltage Transformer Operating Guide is available here: http://www.zeming-e.com/file/0_2013_10_18_093344.pdf Click here to find device on ebay.com <http://www.ebay.com/sch/arduino+voltage+transformer>
X1 = con-molex:22-23-2041: .100" (2.54mm) Center Header - 4 Pin; MF: MOLEX; MPN: 22-23-2041; OC_FARNELL: 1462920; OC_NEWARK: 38C0355
X2 = con-phoenix-508:MKDSN1,5/9-5,08: MKDSN 1,5/ 9-5,08 Printklemme Nennstrom: 13,5 A Nennspannung: 250 V Rastermaß: 5,08 mm Polzahl: 9 Anschlussart: Schraubanschluss Montage: Löten Anschlussrichtung Leiter/Platine: 0 ° Artikelnummer: 1729199 Source: http://eshop.phoenixcontact.com .. 1729199.pdf
X5 = con-phoenix-508:MKDSN1,5/9-5,08: MKDSN 1,5/ 9-5,08 Printklemme Nennstrom: 13,5 A Nennspannung: 250 V Rastermaß: 5,08 mm Polzahl: 9 Anschlussart: Schraubanschluss Montage: Löten Anschlussrichtung Leiter/Platine: 0 ° Artikelnummer: 1729199 Source: http://eshop.phoenixcontact.com .. 1729199.pdf; SPICEPREFIX: X
X6 = con-phoenix-508:MKDSN1,5/4-5,08: MKDSN 1,5/ 4-5,08 Printklemme Nennstrom: 13,5 A Nennspannung: 250 V Rastermaß: 5,08 mm Polzahl: 4 Anschlussart: Schraubanschluss Montage: Löten Anschlussrichtung Leiter/Platine: 0 ° Artikelnummer: 1729144 Source: http://eshop.phoenixcontact.com .. 1729144.pdf